# Altium schematic sheet Thermocouple.SchDoc
size Letter
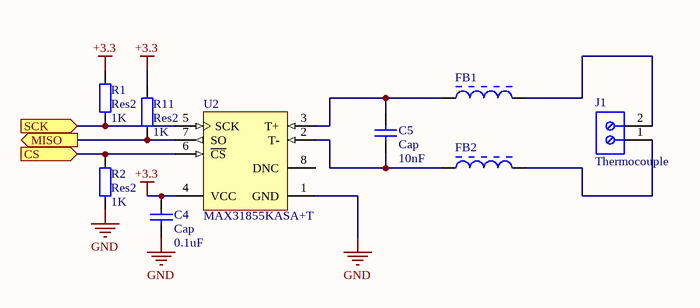
[diagram p0: Thermocouple.SchDoc]

## Parts
C4  Cap  value 0.1uF  [1608[0603]]
C5  Cap  value 10nF  [1608[0603]]
FB1  BLM21AG102SN1D  [6-0805_M]  (value not drawn)
FB2  BLM21AG102SN1D  [6-0805_M]  (value not drawn)
J1  Thermocouple  [691137710002]
R1  Res2  value 1K  [J1-0603]
R2  Res2  value 1K  [J1-0603]
R11  Res2  value 1K  [J1-0603]
U2  MAX31855KASA+T  [MAXM-S8+4_N]

## Ports
CS (in), MISO (out), SCK (in)

## Nets
+3.3: C4.2 R1.2 R11.2 U2.4(VCC)
GND: C4.1 R2.1 U2.1(GND)
CS: R2.2 U2.6(~{CS}) ; port CS
MISO: R11.1 U2.7(SO) ; port MISO
SCK: R1.1 U2.5(SCK) ; port SCK
NetC5_1: C5.1 FB2.1 U2.2(T-)
NetC5_2: C5.2 FB1.1 U2.3(T+)
NetFB1_2: FB1.2 J1.2
NetFB2_2: FB2.2 J1.1

Not connected (* = marked no-connect by the designer): U2 8(DNC)

## Library data of the parts
C4 C5 = Cap: Capacitor; Published: 8-Jun-2000; LatestRevisionDate: 17-Jul-2002; LatestRevisionNote: Re-released for DXP Platform.; PackageReference: RAD-0.3; Publisher: Altium Limited; PackageDescription: Radial Cap, Thru-Hole; 2 Leads; 0.3 in Pin Spacing
FB1 FB2 = MURA-FB-2: Chip Ferrite Bead for General Signal lines, 1000 Ohm, 500 mA, -55 to 125 degC, 2 x 1.25 x 1.05 mm SMD, Tape and Reel; Manufacturer: Murata; Impedance (at 100 MHz): 1000 Ohm +/- 25%; DC Resistance: 0.28 Ohm Max.; Rated Current: 500 mA; ComponentLink1Description: Manufacturer URL; PackageDescription: 2-Pin Chip, Body 2 x 1.25 mm; DatasheetVersion: 08/2013; PartNumber: BLM21AG102SN1D; Mounting Technology: Surface Mount; Operating Temperature Range: -55 to 125 degC; ComponentLink2URL: http://www.murata.com/products/catalog/pdf/c31e.pdf; ComponentLink3Description: Package Specification; ComponentLink2Description: Datasheet; Packing: Tape and Reel; ComponentLink3URL: http://www.murata.com/products/catalog/pdf/c31e.pdf; ComponentLink1URL: http://www.murata.com/; PackageReference: BLM21_H1050-2; LCSC Part #: C1015
J1 = CMP-1502-03324-1: Series 1377 - 5.00 mm Horizontal Entry with Pressure Clamp WR-TBL, 2 pin; Manufacturer: Wurth Elektronik; Pin Number: 2; Pitch: 5.00mm; Operating Temperature: -30to120degC; Package Reference: 691137710002; Publisher: WurthElektronik; Mounting Technology: THT; Manufacturer URL: http://www.we-online.de; Packaging: Box; Part Number: 691137710002; Datasheet URL: http://katalog.we-online.de/pbs/datasheet/691137710002.pdf
R1 R2 R11 = Res2: Resistor; Published: 8-Jun-2000; LatestRevisionDate: 17-Jul-2002; LatestRevisionNote: Re-released for DXP Platform.; PackageReference: AXIAL-0.4; Publisher: Altium Limited; PackageDescription: Axial Device, Thru-Hole; 2 Leads; 0.4 in Pin Spacing
U2 = CMP-0253-00398-1: Cold Junction Compensated Thermocouple to Digital Converter, 14 Bits Temperature Resolution, -40 to 125 degC, 8-Pin SOIC (S8+4), Pb-Free, Tape ang Reel; Interface: SPI; Parasite Pwr.: No; Functions: Thermocouple-to-Digital Converter; ComponentLink3Description: Package Specification; DatasheetVersion: Rev. 2; Generic Part Number: MAX31855; PartNumber: MAX31855KASA+T; PackageReference: S8+4; ComponentLink3URL: http://pdfserv.maximintegrated.com/package_dwgs/21-0041.PDF; Code_JEDEC: MS-012; Packing: Tape ang Reel; PackageDescription: 8-Pin Small-Outline IC, Narrow, Body 3.9 x 4.9 mm, Pitch 1.27 mm; Mounting Technology: Surface Mount; ComponentLink1URL: http://www.maximintegrated.com/; PackageVersion: Rev. D, 10/2012; ComponentLink2URL: http://datasheets.maximintegrated.com/en/ds/MAX31855.pdf; ComponentLink1Description: Manufacturer URL; ComponentLink2Description: Datasheet